# Altium schematic sheet Leptons Voltmeter.SchDoc: Voltemeter
size A; SheetNumber: 1; SheetTotal: 1
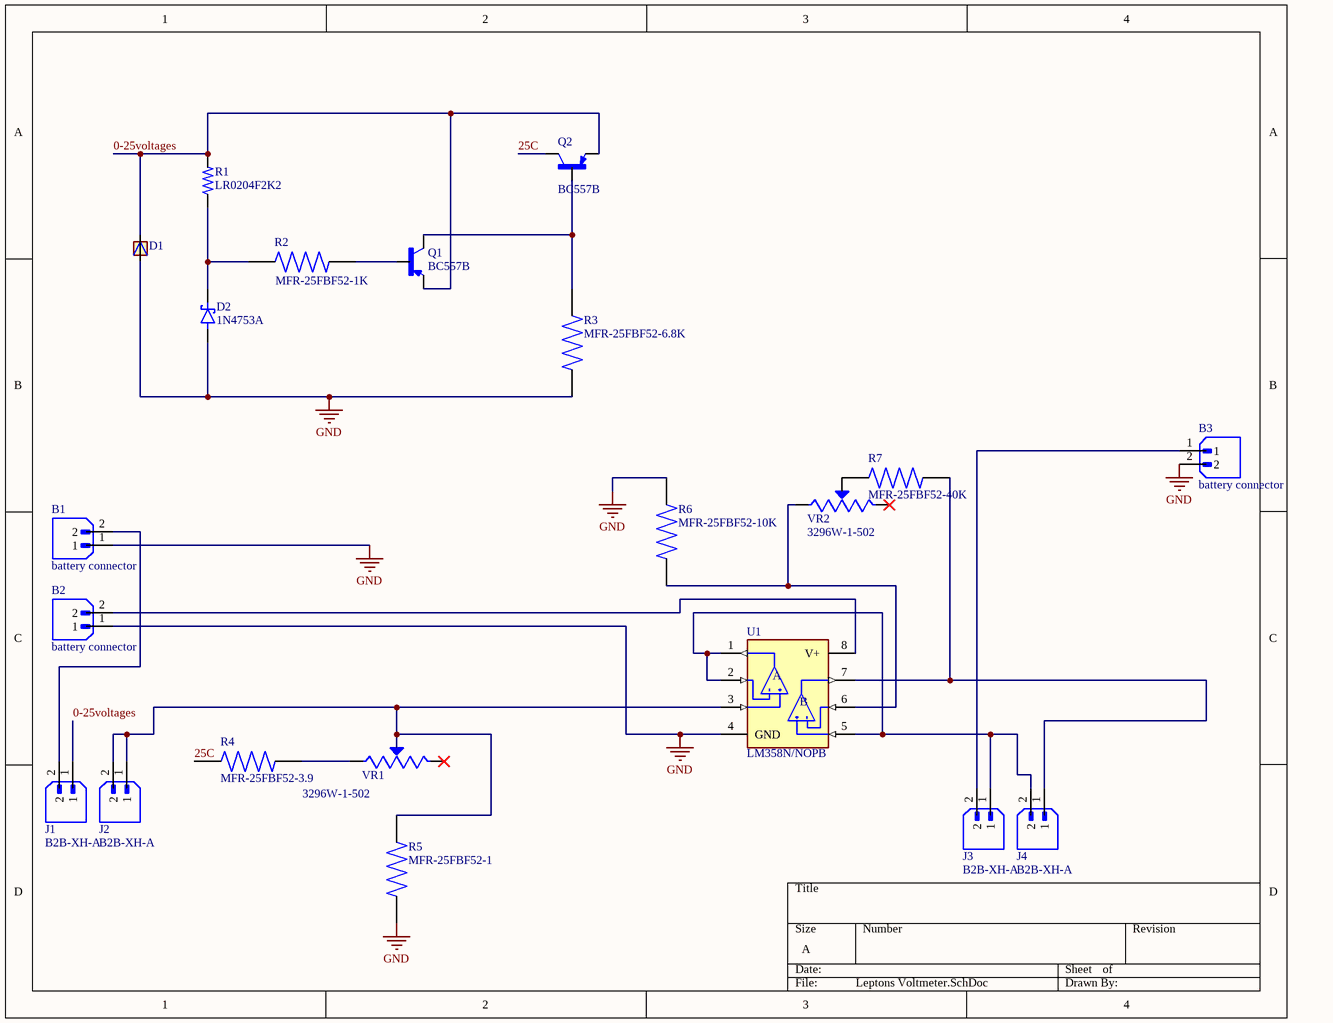
[diagram p0: Leptons Voltmeter.SchDoc]

## Parts
B1  battery connector  [JST_B2B-XH-A(LF)(SN)]
B2  battery connector  [JST_B2B-XH-A(LF)(SN)]
B3  battery connector  [JST_B2B-XH-A(LF)(SN)]
D1  1N4004G  [DO41-10]  (value not drawn)
D2  1N4753A  [DIOAD1036W78L463D272]
J1  B2B-XH-A  [JST_B2B-XH-A]
J2  B2B-XH-A  [JST_B2B-XH-A]
J3  B2B-XH-A  [JST_B2B-XH-A]
J4  B2B-XH-A  [JST_B2B-XH-A]
Q1  BC557B  [TO92254P460H750-3]
Q2  BC557B  [TO92254P460H750-3]
R1  LR0204F2K2  [RESAD640W45L370D200]
R2  MFR-25FBF52-1K  [RESAD1100W55L680D260]
R3  MFR-25FBF52-6.8K  [RESAD1100W55L680D260]
R4  MFR-25FBF52-3.9  [RESAD1100W55L680D260]
R5  MFR-25FBF52-1  [RESAD1100W55L680D260]
R6  MFR-25FBF52-10K  [RESAD1100W55L680D260]
R7  MFR-25FBF52-40K  [RESAD1100W55L680D260]
U1  LM358N/NOPB  [DIP794W45P254L959H508Q8]
VR1  3296W-1-502  [TRIM_3296W-1-502]
VR2  3296W-1-502  [TRIM_3296W-1-502]

## Nets
GND: B1.1 B2.1 B3.2 D1.A D2.2(A) R3.2 R5.1 R6.2 U1.4(GND)
0-25voltages: D1.C J1.1 Q1.3(E) Q2.3(E) R1.2
25C: Q2.1(C) R4.1
NetB1_2: B1.2 J1.2
NetB2_2: B2.2 U1.8(V+)
NetB3_1: B3.1 J3.2
NetD2_1: D2.1(K) R1.1 R2.1
NetJ2_1: J2.1 J2.2 R5.2 U1.3(+INA) VR1.2(WIPER)
NetJ3_1: J3.1 J4.2 U1.1(OUTA) U1.2(-INA) U1.5(+INB)
NetJ4_1: J4.1 R7.2 U1.7(OUTB)
NetQ1_1: Q1.1(C) Q2.2(B) R3.1
NetQ1_2: Q1.2(B) R2.2
NetR4_2: R4.2 VR1.1(CCW)
NetR6_1: R6.1 U1.6(-INB) VR2.1(CCW)
NetR7_1: R7.1 VR2.2(WIPER)

Not connected (* = marked no-connect by the designer): VR1 3(CW)*; VR2 3(CW)*

## Notes on the sheet
- (in symbol LM358N/NOPB) A; B

## Library data of the parts
D1 = 1N4004G: Diode Standard 400 V 1A Through Hole DO-41; MF: Diodes Inc.; MP: 1N4004G-T; SnapEDA_Link: https://www.snapeda.com/parts/1N4004G-T/Diodes+Inc./view-part/?ref=snap; Package: DO-41 Diodes Inc.; Value: *; Check_prices: https://www.snapeda.com/parts/1N4004G-T/Diodes+Inc./view-part/?ref=eda
D2 = 1N4753A: Zener Diode Single 36V 5% 50Ohm 1000mW 2-Pin; MF: ON Semiconductor; SnapEDA_Link: https://www.snapeda.com/parts/1N4753A/Onsemi/view-part/?ref=snap; Package: DO-41 ON Semiconductor; Value: *; MP: 1N4753A; Check_prices: https://www.snapeda.com/parts/1N4753A/Onsemi/view-part/?ref=eda
J1-J4 = B2B-XH-A: MF: {'manufacturer': u'JST Sales America Inc.'}; Package: None; Price: None; Value: *; MP: B2B-XH-A; Availability: Unavailable
Q1 Q2 = BC557B: Bipolar (BJT) Transistor PNP 45 V 100 mA 320MHz 625 mW Through Hole TO-92 (TO-226); MF: ON Semiconductor; SnapEDA_Link: https://www.snapeda.com/parts/BC557B/Onsemi/view-part/?ref=snap; Package: E-PKG AXIAL-LEADED-2 ON Semiconductor; Value: *; MP: BC557B; Check_prices: https://www.snapeda.com/parts/BC557B/Onsemi/view-part/?ref=eda
R1 = LR0204F2K2: 2.2 kOhms Â±1% 0.25W, 1/4W Through Hole Resistor Axial - Metal Film; MF: TE Connectivity Passive Product; SnapEDA_Link: https://www.snapeda.com/parts/LR0204F2K2/TE/view-part/?ref=snap; Package: Axial TE Connectivity Passive Product; Value: *; MP: LR0204F2K2; Check_prices: https://www.snapeda.com/parts/LR0204F2K2/TE/view-part/?ref=eda
R2-R7 = MFR-25FBF52-1K: 1.07 kOhms Â±1% 0.25W, 1/4W Through Hole Resistor Axial - Metal Film; MF: Yageo; SnapEDA_Link: https://www.snapeda.com/parts/MFR-25FBF52-1K/Yageo/view-part/?ref=snap; Package: RADIAL-2 YAGEO; Value: *; MP: MFR-25FBF52-1K; Check_prices: https://www.snapeda.com/parts/MFR-25FBF52-1K/Yageo/view-part/?ref=eda
U1 = LM358N/NOPB: Dual, 32-V, 1-MHz op amp; MF: Texas Instruments; SnapEDA_Link: https://www.snapeda.com/parts/LM358N/NOPB/Texas+Instruments/view-part/?ref=snap; Package: PDIP-8 Texas; Value: *; MP: LM358N/NOPB; Check_prices: https://www.snapeda.com/parts/LM358N/NOPB/Texas+Instruments/view-part/?ref=eda
VR1 VR2 = 3296W-1-502: NON-RoHS, 3/8 Sq, Thru-Hole, TRIMMER, 5 Kohms, Cermet, 25 Turns, Pwr-Rtg 0.5W | Bourns 3296W-1-502; SnapEDA_Link: https://www.snapeda.com/parts/3296W-1-502/Bourns/view-part/?ref=snap; Package: NON STANDARD-3 Bourns; Value: *; MF: Bourns; MP: 3296W-1-502; Check_prices: https://www.snapeda.com/parts/3296W-1-502/Bourns/view-part/?ref=eda